# Altium schematic sheet 7SEGMENT.SchDoc
size A4; SheetNumber: 5; SheetTotal: 8
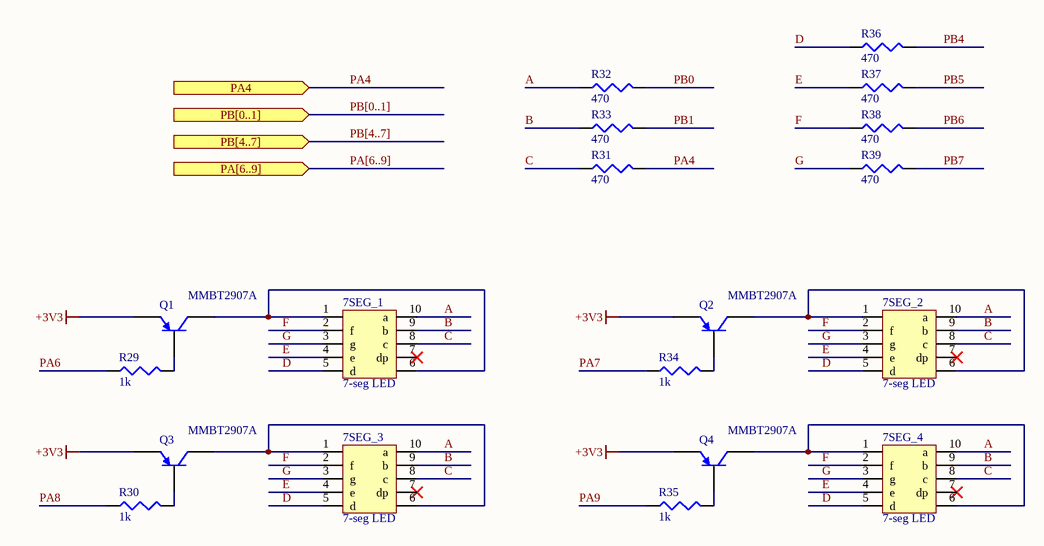
[diagram p0: 7SEGMENT.SchDoc]

## Parts
7SEG_1  7-seg LED  [7-seg LED 0.36inch]
7SEG_2  7-seg LED  [7-seg LED 0.36inch]
7SEG_3  7-seg LED  [7-seg LED 0.36inch]
7SEG_4  7-seg LED  [7-seg LED 0.36inch]
Q1  MMBT2907A  [FAIR-SOT23-3_V]
Q2  MMBT2907A  [FAIR-SOT23-3_V]
Q3  MMBT2907A  [FAIR-SOT23-3_V]
Q4  MMBT2907A  [FAIR-SOT23-3_V]
R29  1k  [0805 (2012 Metric)]
R30  1k  [0805 (2012 Metric)]
R31  470  [0805 (2012 Metric)]
R32  470  [0805 (2012 Metric)]
R33  470  [0805 (2012 Metric)]
R34  1k  [0805 (2012 Metric)]
R35  1k  [0805 (2012 Metric)]
R36  470  [0805 (2012 Metric)]
R37  470  [0805 (2012 Metric)]
R38  470  [0805 (2012 Metric)]
R39  470  [0805 (2012 Metric)]

## Ports
PA4 (in), PA[6..9] (in), PB[0..1] (in), PB[4..7] (in)

## Nets
+3V3: Q1.2(E) Q2.2(E) Q3.2(E) Q4.2(E)
A: 7SEG_1.10(a) 7SEG_2.10(a) 7SEG_3.10(a) 7SEG_4.10(a) R32.1
B: 7SEG_1.9(b) 7SEG_2.9(b) 7SEG_3.9(b) 7SEG_4.9(b) R33.1
C: 7SEG_1.8(c) 7SEG_2.8(c) 7SEG_3.8(c) 7SEG_4.8(c) R31.1
D: 7SEG_1.5(d) 7SEG_2.5(d) 7SEG_3.5(d) 7SEG_4.5(d) R36.1
E: 7SEG_1.4(e) 7SEG_2.4(e) 7SEG_3.4(e) 7SEG_4.4(e) R37.1
F: 7SEG_1.2(f) 7SEG_2.2(f) 7SEG_3.2(f) 7SEG_4.2(f) R38.1
G: 7SEG_1.3(g) 7SEG_2.3(g) 7SEG_3.3(g) 7SEG_4.3(g) R39.1
PA4: R31.2 ; port PA4
PA6: R29.1
PA7: R34.1
PA8: R30.1
PA9: R35.1
PB0: R32.2
PB1: R33.2
PB4: R36.2
PB5: R37.2
PB6: R38.2
PB7: R39.2
Net7SEG_1_1: 7SEG_1.1 7SEG_1.6(VCC/GND) Q1.3(C)
Net7SEG_2_1: 7SEG_2.1 7SEG_2.6(VCC/GND) Q2.3(C)
Net7SEG_3_1: 7SEG_3.1 7SEG_3.6(VCC/GND) Q3.3(C)
Net7SEG_4_1: 7SEG_4.1 7SEG_4.6(VCC/GND) Q4.3(C)
NetQ1_1: Q1.1(B) R29.2
NetQ2_1: Q2.1(B) R34.2
NetQ3_1: Q3.1(B) R30.2
NetQ4_1: Q4.1(B) R35.2

Not connected (* = marked no-connect by the designer): 7SEG_1 7(dp)*; 7SEG_2 7(dp)*; 7SEG_3 7(dp)*; 7SEG_4 7(dp)*

## Buses and harness runs
bus PA[6..9] = port PA[6..9]
bus PB[0..1] = port PB[0..1]
bus PB[4..7] = port PB[4..7]

## Library data of the parts
7SEG_1-7SEG_4 = CMP-007-00037-2: Source: LEDs.SchLib; Design Item ID: 7-seg LED
Q1-Q4 = CMP-013-00008-4: Manufacturer: Fairchild; Power: 350mW; Package Version: Rev. 12, 03/2016; Vce Max: 400mV; hFE Min: 100; Elements: 1; Frequency: 250MHz; Package Quantity: 3000; Mounting Technology: SM; Case/Package: TO-236-3; Package Description: 3-Pin Small Outline Transistor, Body 2.92 x 1.325 mm, Pitch 0.95 mm; Package Reference: SOT23-3; Pins: 3; Datasheet Version: Rev. 1.2.2, 04/2014; Max Operating Temperature: 150°C; Min Operating Temperature: -55°C; Packaging: TapeandReel; RoHS Compliant: True; Datasheet URL: https://www.fairchildsemi.com/datasheets/MM/MMBT3906.pdf; JLCPCB Part #: C2972764
R29-R39 = CMP-009-00179-13: Oreki; ComponentLink1Description: DigiKey; RoHS Compliant: Yes; Mounting Technology: SMT; Pins: 2; Case/Package: Chip
  R29 R30 R34 R35: Value: 1k
  R31-R33 R36-R39: Value: 470